# EAGLE design ctrl-pico (EAGLE 9.6.2)
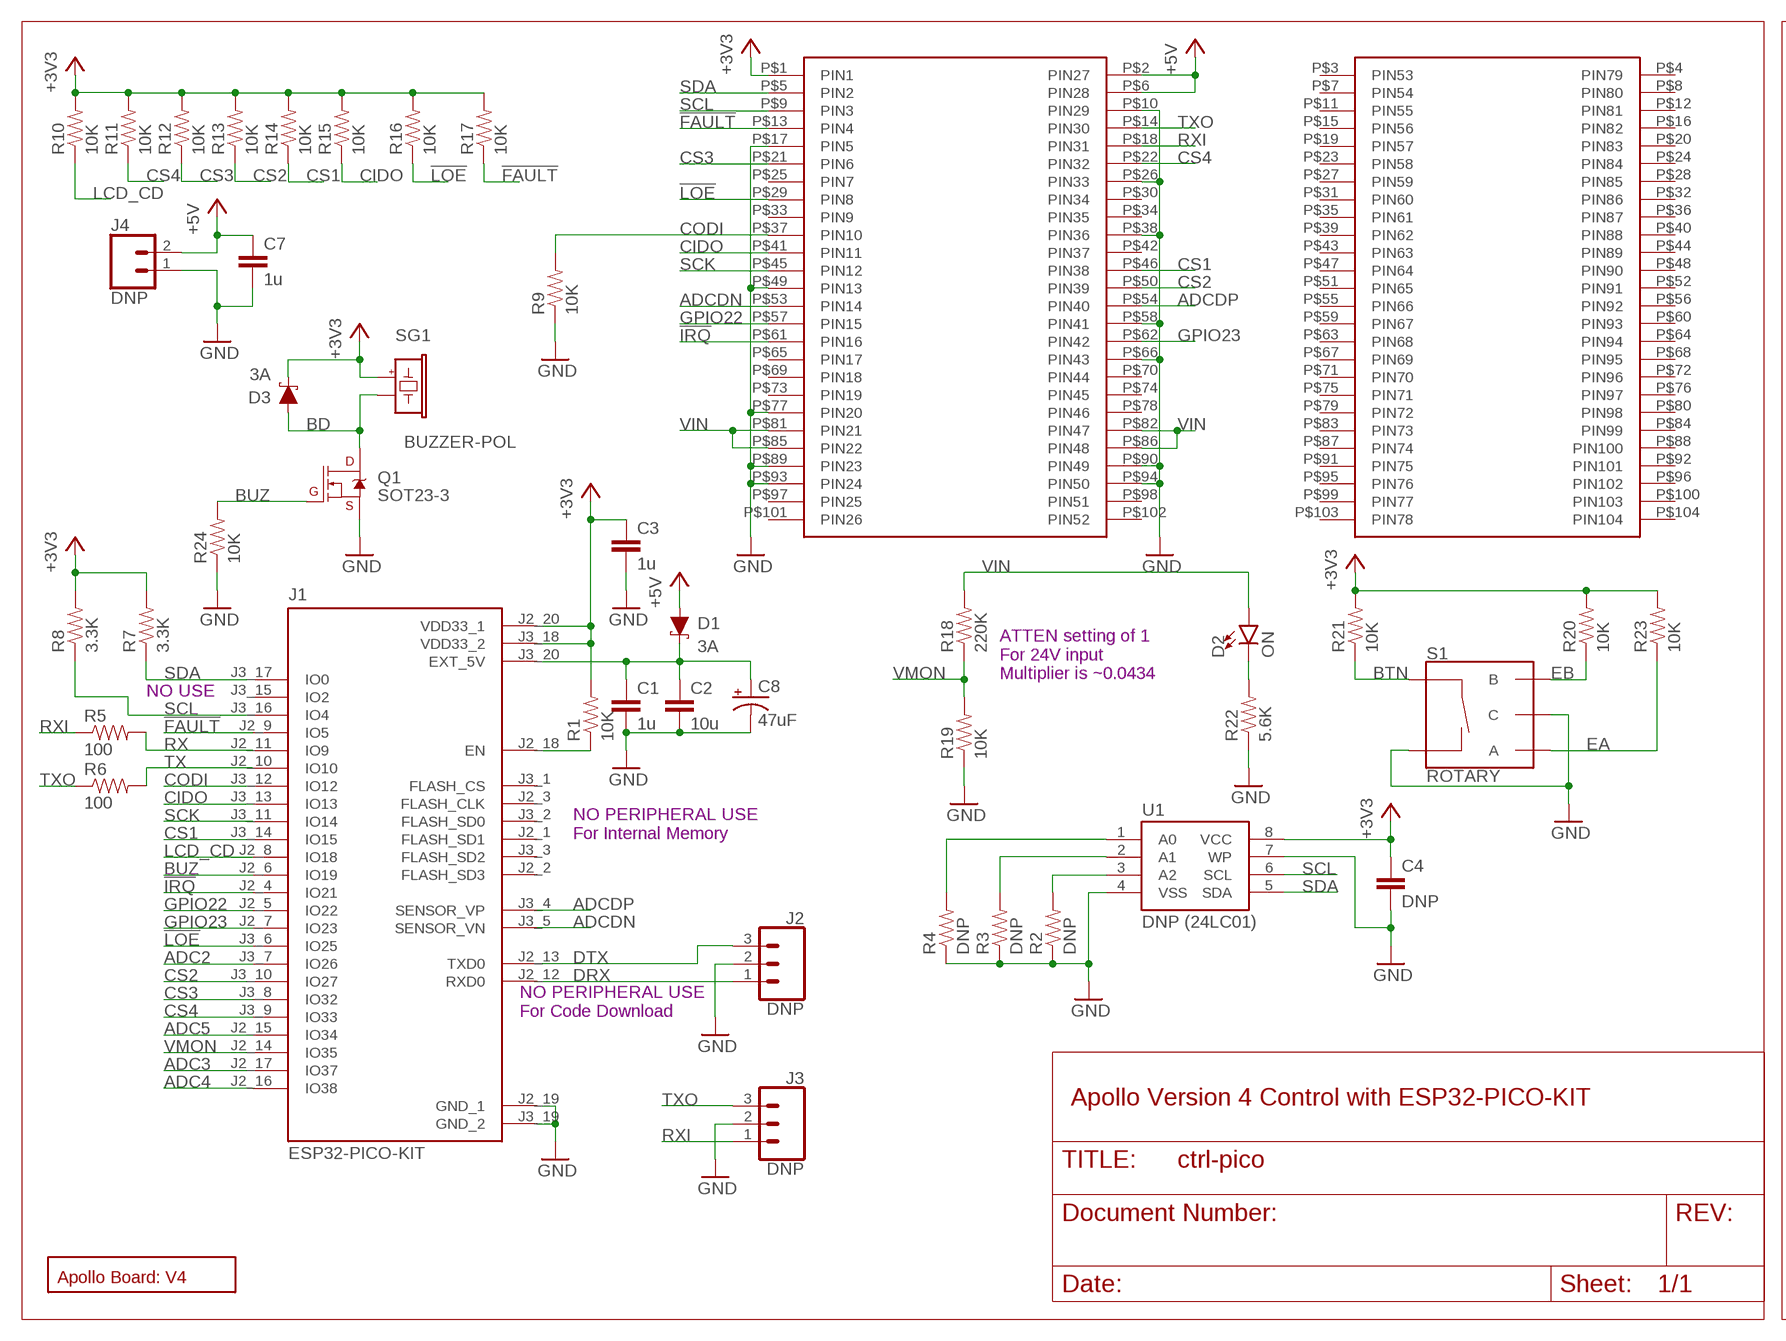
[diagram p0: schematic, sheet 1, part 1 of 2]
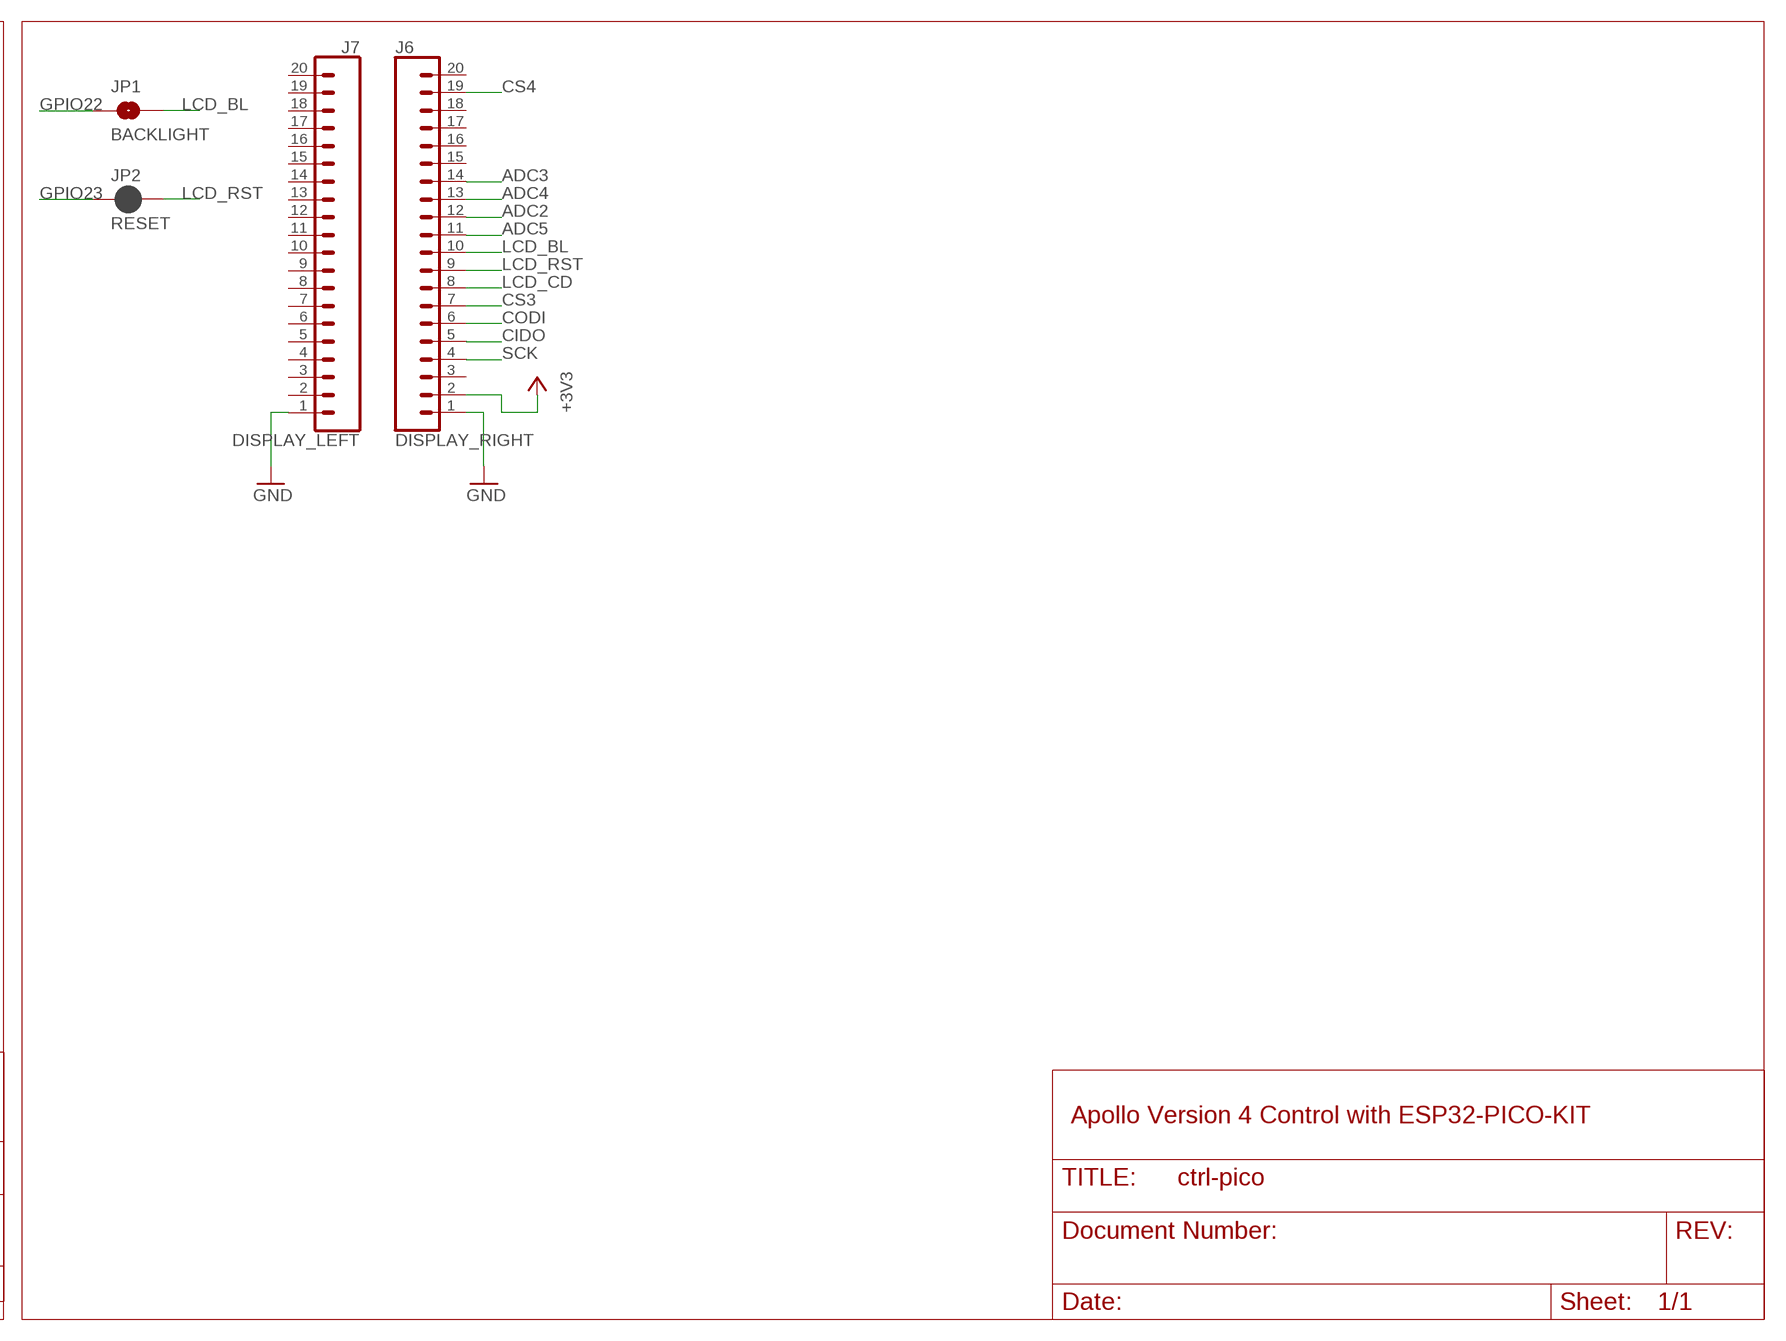
[diagram p1: schematic, sheet 1, part 2 of 2]

## Parts
C1  1u  CAP0805  [0805]
C2  10u  CAP0805  [0805]
C3  1u  CAP0805  [0805]
C4  DNP  CAP0805  [0805]
C7  1u  CAP0805  [0805]
C8  47uF  47UF-POLAR-PANASONIC_D-35V-20%  [PANASONIC_D]
D1  3A  DIODE-SCHOTTKY-B340A  [SMA-DIODE]
D2  ON  LED-GREEN0603  [LED-0603]
D3  3A  DIODE-SCHOTTKY-B340A  [SMA-DIODE]
J1  ESP32-PICO-KIT  [XCVR_ESP32-PICO-KIT]
J2  DNP  CONN_03  [1X03]
J3  DNP  CONN_03  [1X03]
J4  DNP  CONN_02  [1X02]
J6  DISPLAY_RIGHT  CONN_20  [1X20]
J7  DISPLAY_LEFT  CONN_20  [1X20]
JP1  BACKLIGHT  JUMPER-SMT_2_NO_NO-SILK  [SMT-JUMPER_2_NO_NO-SILK]
JP2  RESET  JUMPER-SMT_2_NC_PASTE_NO-SILK  [SMT-JUMPER_2_NC_PASTE_NO-SILK]
Q1  SOT23-3  MOSFET-NCH-AO3404A  [SOT23-3]
R1  10K  RESISTOR0805-RES  [0805]
R2  DNP  RESISTOR0805-RES  [0805]
R3  DNP  RESISTOR0805-RES  [0805]
R4  DNP  RESISTOR0805-RES  [0805]
R5  100  RESISTOR0805-RES  [0805]
R6  100  RESISTOR0805-RES  [0805]
R7  3.3K  RESISTOR0805-RES  [0805]
R8  3.3K  RESISTOR0805-RES  [0805]
R9  10K  RESISTOR0805-RES  [0805]
R10  10K  RESISTOR0805-RES  [0805]
R11  10K  RESISTOR0805-RES  [0805]
R12  10K  RESISTOR0805-RES  [0805]
R13  10K  RESISTOR0805-RES  [0805]
R14  10K  RESISTOR0805-RES  [0805]
R15  10K  RESISTOR0805-RES  [0805]
R16  10K  RESISTOR0805-RES  [0805]
R17  10K  RESISTOR0805-RES  [0805]
R18  220K  RESISTOR0805-RES  [0805]
R19  10K  RESISTOR0805-RES  [0805]
R20  10K  RESISTOR0805-RES  [0805]
R21  10K  RESISTOR0805-RES  [0805]
R22  5.6K  RESISTOR0805-RES  [0805]
R23  10K  RESISTOR0805-RES  [0805]
R24  10K  RESISTOR0805-RES  [0805]
S1  ROTARY  ENCODER-SWITCH  [ROTARY_ENC_PLAIN]
SG1  BUZZER-POL  [BUZZER-SMT-4]
U1  DNP (24LC01)  EEPROM-I2CSMD  [SO08]
U$1  PC104_CONNECTOR  [PC104_CONNECTOR]
U$2  BOARD_TEMPLATE1  [BOARD_TEMPLATE]

## Nets
!FAULT!: J1.J2_9(IO5) R17.1 U$1.P$13(PIN4)
!IRQ!: J1.J2_4(IO21) U$1.P$61(PIN16)
!LOE!: J1.J3_6(IO25) R16.1 U$1.P$29(PIN8)
+3V3: C3.1 C4.1 D3.C J1.J2_20(VDD33_1) J1.J3_18(VDD33_2) J6.2 R1.2 R7.2 R8.2 R10.2 R11.2 R12.2 R13.2 R14.2 R15.2 R16.2 R17.2 R20.2 R21.2 R23.2 SG1.BP(P) U1.8(VCC) U$1.P$1(PIN1)
+5V: C7.1 D1.A J4.2 U$1.P$2(PIN27) U$1.P$6(PIN28)
A0: R4.2 U1.1(A0)
A1: R3.2 U1.2(A1)
A2: R2.2 U1.3(A2)
ADC2: J1.J3_7(IO26) J6.12
ADC3: J1.J2_17(IO37) J6.14
ADC4: J1.J2_16(IO38) J6.13
ADC5: J1.J2_15(IO34) J6.11
ADCDN: J1.J3_5(SENSOR_VN) U$1.P$53(PIN14)
ADCDP: J1.J3_4(SENSOR_VP) U$1.P$54(PIN40)
BD: D3.A Q1.3(D) SG1.BM(N)
BTN: R21.1 S1.SW+
BUZ: J1.J2_6(IO19) Q1.1(G) R24.2
CIDO: J1.J3_13(IO13) J6.5 R15.1 U$1.P$41(PIN11)
CODI: J1.J3_12(IO12) J6.6 R9.2 U$1.P$37(PIN10)
CS1: J1.J3_14(IO15) R14.1 U$1.P$46(PIN38)
CS2: J1.J3_10(IO27) R13.1 U$1.P$50(PIN39)
CS3: J1.J3_8(IO32) J6.7 R12.1 U$1.P$21(PIN6)
CS4: J1.J3_9(IO33) J6.19 R11.1 U$1.P$22(PIN32)
DRX: J1.J2_12(RXD0) J2.1
DTX: J1.J2_13(TXD0) J2.3
EA: R23.1 S1.A
EB: R20.1 S1.B
EN: J1.J2_18(EN) R1.1
GND: C1.2 C2.2 C3.2 C4.2 C7.2 C8.- J1.J2_19(GND_1) J1.J3_19(GND_2) J2.2 J3.2 J4.1 J6.1 J7.1 Q1.2(S) R2.1 R3.1 R4.1 R9.1 R19.1 R22.1 R24.1 S1.C S1.SW- U1.4(VSS) U1.7(WP) U$1.P$10(PIN29) U$1.P$17(PIN5) U$1.P$26(PIN33) U$1.P$38(PIN36) U$1.P$49(PIN13) U$1.P$58(PIN41) U$1.P$66(PIN43) U$1.P$77(PIN20) U$1.P$89(PIN23) U$1.P$90(PIN49) U$1.P$93(PIN24) U$1.P$94(PIN50)
GPIO22: J1.J2_5(IO22) JP1.1 U$1.P$57(PIN15)
GPIO23: J1.J2_7(IO23) JP2.1 U$1.P$62(PIN42)
LCD_BL: J6.10 JP1.2
LCD_CD: J1.J2_8(IO18) J6.8 R10.1
LCD_RST: J6.9 JP2.2
RX: J1.J2_11(IO9) R5.2
RXI: J3.1 R5.1 U$1.P$18(PIN31)
SCK: J1.J3_11(IO14) J6.4 U$1.P$45(PIN12)
SCL: J1.J3_16(IO4) R8.1 U1.6(SCL) U$1.P$9(PIN3)
SDA: J1.J3_17(IO0) R7.1 U1.5(SDA) U$1.P$5(PIN2)
TX: J1.J2_10(IO10) R6.2
TXO: J3.3 R6.1 U$1.P$14(PIN30)
USB5V: C1.1 C2.1 C8.+ D1.C J1.J3_20(EXT_5V)
VIN: D2.A R18.2 U$1.P$81(PIN21) U$1.P$82(PIN47) U$1.P$85(PIN22) U$1.P$86(PIN48)
VLED: D2.C R22.2
VMON: J1.J2_14(IO35) R18.1 R19.2
Unconnected: J1.J2_1(FLASH_SD1) J1.J2_2(FLASH_SD3) J1.J2_3(FLASH_CLK) J1.J3_1(FLASH_CS) J1.J3_2(FLASH_SD0) J1.J3_3(FLASH_SD2) J1.J3_15(IO2) J6.3 J6.15 J6.16 J6.17 J6.18 J6.20 J7.2 J7.3 J7.4 J7.5 J7.6 J7.7 J7.8 J7.9 J7.10 J7.11 J7.12 J7.13 J7.14 J7.15 J7.16 J7.17 J7.18 J7.19 J7.20 U$1.P$3(PIN53) U$1.P$4(PIN79) U$1.P$7(PIN54) U$1.P$8(PIN80) U$1.P$11(PIN55) U$1.P$12(PIN81) U$1.P$15(PIN56) U$1.P$16(PIN82) U$1.P$19(PIN57) U$1.P$20(PIN83) U$1.P$23(PIN58) U$1.P$24(PIN84) U$1.P$25(PIN7) U$1.P$27(PIN59) U$1.P$28(PIN85) U$1.P$30(PIN34) U$1.P$31(PIN60) U$1.P$32(PIN86) U$1.P$33(PIN9) U$1.P$34(PIN35) U$1.P$35(PIN61) U$1.P$36(PIN87) U$1.P$39(PIN62) U$1.P$40(PIN88) U$1.P$42(PIN37) U$1.P$43(PIN63) U$1.P$44(PIN89) U$1.P$47(PIN64) U$1.P$48(PIN90) U$1.P$51(PIN65) U$1.P$52(PIN91) U$1.P$55(PIN66) U$1.P$56(PIN92) U$1.P$59(PIN67) U$1.P$60(PIN93) U$1.P$63(PIN68) U$1.P$64(PIN94) U$1.P$65(PIN17) U$1.P$67(PIN69) U$1.P$68(PIN95) U$1.P$69(PIN18) U$1.P$70(PIN44) U$1.P$71(PIN70) U$1.P$72(PIN96) U$1.P$73(PIN19) U$1.P$74(PIN45) U$1.P$75(PIN71) U$1.P$76(PIN97) U$1.P$78(PIN46) U$1.P$79(PIN72) U$1.P$80(PIN98) U$1.P$83(PIN73) U$1.P$84(PIN99) U$1.P$87(PIN74) U$1.P$88(PIN100) U$1.P$91(PIN75) U$1.P$92(PIN101) U$1.P$95(PIN76) U$1.P$96(PIN102) U$1.P$97(PIN25) U$1.P$98(PIN51) U$1.P$99(PIN77) U$1.P$100(PIN103) U$1.P$101(PIN26) U$1.P$102(PIN52) U$1.P$103(PIN78) U$1.P$104(PIN104)

## Notes on the sheet
- ATTEN setting of 1
  For 24V input
  Multiplier is ~0.0434
- NO USE
- NO PERIPHERAL USE
  For Internal Memory
- NO PERIPHERAL USE
  For Code Download
- Apollo Version 4 Control with ESP32-PICO-KIT
- Apollo Version 4 Control with ESP32-PICO-KIT

## Library data of the parts
C1-C4 C7 = apollo-ctrl-v4:CAP: Capacitor Standard 0603 ceramic capacitor, and 0.1" leaded capacitor.
C8 = SparkFun-Capacitors:47UF-POLAR: 47µF polarized capacitors A capacitor is a passive two-terminal electrical component used to store electrical energy temporarily in an electric field.; PROD_ID: CAP-08478
D1 D3 = SparkFun-DiscreteSemi:DIODE-SCHOTTKY: Schottky diode A Schottky diode is a semiconductor diode which has a low forward voltage drop and a very fast switching action.; PROD_ID: DIO-09886; VALUE: 3A/40V/500mV
D2 = SparkFun-LED:LED-GREEN: Green SMD LED Used in manufacturing of various products at SparkFun Packages: 0603 - SMD 0603 package [Product Link] <http://www.futureelectronics.com/en/technologies/semiconductors/optoelectronics/leds/Pages/9894312-LTST-C190GKT.aspx?CrossPart=HSMG-C190&IM=0> LilyPad 1206 - SMD1206 LilyPad package [Product Link] <http://www.futureelectronics.com/en/Technologies/Product.aspx?ProductID=IN150NGHARVATEKCORPORATION2049943&IM=0> 1206 - SMD1206 package [Product Link] <http://www.futureelectronics.com/en/technologies/semiconductors/optoelectronics/leds/Pages/8315665-LTST-C150KGKT.aspx?IM=0> 1206 Bottom Mount -SMD 1206 Bottom Mount [Product Link] <http://www.digikey.com/product-detail/en/lite-on-inc/LTST-C230KGKT/160-1456-1-ND/386854> SparkFun Products: Pro Mini 328 -5V <https://www.sparkfun.com/products/821> RedBoard <https://www.sparkfun.com/products/12757> MP3 Trigger <https://www.sparkfun.com/products/13720> Makey Makey <https://www.sparkfun.com/products/11076>; PROD_ID: DIO-00821; VALUE: GREEN
J1 = ESP32-PICO-KIT:ESP32-PICO-KIT: Esp32 Wifi Bluetooth Eval Board; DESCRIPTION: - Transceiver; 802.11 b/g/n (Wi-Fi, WiFi, WLAN), Bluetooth® Smart Ready 4.x Dual Mode For Use With ESP32-PICO-D4; DIGI-KEY_PART_NUMBER: 1965-1004-ND; DIGIKEY-PURCHASE-URL: https://snapeda.com/shop?store=DigiKey&id=2777057; MF: Espressif Systems; MOUSER-PURCHASE-URL: https://snapeda.com/shop?store=Mouser&id=2777057; MP: ESP32-PICO-KIT; PACKAGE: None
J2 J3 = SparkFun-Connectors:CONN_03: Multi connection point. Often used as Generic Header-pin footprint for 0.1 inch spaced/style header connections On any of the 0.1 inch spaced packages, you can populate with these: Break Away Headers - Straight <https://www.sparkfun.com/products/116> (PRT-00116) Break Away Male Headers - Right Angle <https://www.sparkfun.com/products/553> (PRT-00553) Female Headers <https://www.sparkfun.com/products/115> (PRT-00115) Break Away Headers - Machine Pin <https://www.sparkfun.com/products/117> (PRT-00117) Break Away Female Headers - Swiss Machine Pin <https://www.sparkfun.com/products/743> (PRT-00743) Stackable Header - 3 Pin (Female, 0.1") <https://www.sparkfun.com/products/13875> (PRT-13875) For SCREWTERMINALS and SPRING TERMINALS visit here: Screw Terimnals on SparkFun.com <https://www.sparkfun.com/search/results?term=Screw+Terminals> (5mm/3.5mm/2.54mm spacing) This device is also useful as a general connection point to wire up your design to another part of your project. Our various solder wires solder well into these plated through hole pads. Hook-Up Wire - Assortment (Stranded, 22 AWG) <https://www.sparkfun.com/products/11375> (PRT-11375) Hook-Up Wire - Assortment (Solid Core, 22 AWG) <https://www.sparkfun.com/products/11367> (PRT-11367) View the entire wire category on our website here <https://www.sparkfun.com/categories/141> Special notes: Molex polarized connector foot print use with SKU : PRT-08232 with associated crimp pins and housings.; PROD_ID: XXX-00000; VALUE: 455-1750-1-ND
J4 = SparkFun-Connectors:CONN_02: Multi connection point. Often used as Generic Header-pin footprint for 0.1 inch spaced/style header connections On any of the 0.1 inch spaced packages, you can populate with these: Break Away Headers - Straight <https://www.sparkfun.com/products/116> (PRT-00116) Break Away Male Headers - Right Angle <https://www.sparkfun.com/products/553> (PRT-00553) Female Headers <https://www.sparkfun.com/products/115> (PRT-00115) Break Away Headers - Machine Pin <https://www.sparkfun.com/products/117> (PRT-00117) Break Away Female Headers - Swiss Machine Pin <https://www.sparkfun.com/products/743> (PRT-00743) For SCREWTERMINALS and SPRING TERMINALS visit here: Screw Terimnals on SparkFun.com <https://www.sparkfun.com/search/results?term=Screw+Terminals> (5mm/3.5mm/2.54mm spacing) This device is also useful as a general connection point to wire up your design to another part of your project. Our various solder wires solder well into these plated through hole pads. Hook-Up Wire - Assortment (Stranded, 22 AWG) <https://www.sparkfun.com/products/11375> (PRT-11375) Hook-Up Wire - Assortment (Solid Core, 22 AWG) <https://www.sparkfun.com/products/11367> (PRT-11367) View the entire wire category on our website here <https://www.sparkfun.com/categories/141> Special notes: Molex polarized connector foot print use with: PRT-08233 with associated crimp pins and housings. 2.54_SCREWTERM for use with PRT-10571. 3.5mm Screw Terminal footprints for PRT-08084 5mm Screw Terminal footprints for use with PRT-08432
J6 J7 = SparkFun-Connectors:CONN_20: Multi connection point. Often used as Generic Header-pin footprint for 0.1 inch spaced/style header connections On any of the 0.1 inch spaced packages, you can populate with these: Break Away Headers - Straight <https://www.sparkfun.com/products/116> (PRT-00116) Break Away Male Headers - Right Angle <https://www.sparkfun.com/products/553> (PRT-00553) Female Headers <https://www.sparkfun.com/products/115> (PRT-00115) Break Away Headers - Machine Pin <https://www.sparkfun.com/products/117> (PRT-00117) Break Away Female Headers - Swiss Machine Pin <https://www.sparkfun.com/products/743> (PRT-00743) For SCREWTERMINALS and SPRING TERMINALS visit here: Screw Terimnals on SparkFun.com <https://www.sparkfun.com/search/results?term=Screw+Terminals> (5mm/3.5mm/2.54mm spacing) This device is also useful as a general connection point to wire up your design to another part of your project. Our various solder wires solder well into these plated through hole pads. Hook-Up Wire - Assortment (Stranded, 22 AWG) <https://www.sparkfun.com/products/11375> (PRT-11375) Hook-Up Wire - Assortment (Solid Core, 22 AWG) <https://www.sparkfun.com/products/11367> (PRT-11367) View the entire wire category on our website here <https://www.sparkfun.com/categories/141> Special notes: Molex polarized connector foot print use with SKU : PRT-08231 with associated crimp pins and housings. 1MM SMD Version SKU: PRT-10208 NOTES ON THE VARIANTS LOCK and LOCK_LONGPADS... This footprint was designed to help hold the alignment of a through-hole component (i.e. 6-pin header) while soldering it into place. You may notice that each hole has been shifted either up or down by 0.005 of an inch from it's more standard position (which is a perfectly straight line). This slight alteration caused the pins (the squares in the middle) to touch the edges of the holes. Because they are alternating, it causes a "brace" to hold the component in place. 0.005 has proven to be the perfect amount of "off-center" position when using our standard breakaway headers. Although looks a little odd when you look at the bare footprint, once you have a header in there, the alteration is very hard to notice. Also,if you push a header all the way into place, it is covered up entirely on the bottom side. Note about LOCK SPECIAL package: This is just like the LOCK variant in that the holes are staggared by 5 mil, but except for the last two holes. They are not altered from the "standard" footprint layout. This is used for a special purpose on the layout of our Graphic LCD Backpack. Make sure you want to use this device before selecting it for you project!
JP1 = SparkFun-Jumpers:JUMPER-SMT_2_NO: Normally open jumper This jumper has two pads in close proximity to each other. Apply solder to close the connection. Round pads are easier to solder for beginners, but are a lot larger. SparkFun Product that uses the round pads: SparkFun EL Sequencer <https://www.sparkfun.com/products/12781>
JP2 = SparkFun-Jumpers:JUMPER-SMT_2_NC_PASTE: Normally closed solder jumper This jumper has an aperture in the stencil to allow solder paste to bridge the split in the wire so it's normally closed (NC). Wick off the solder to open the connection. Reapply solder to reclose the connection.
Q1 = SparkFun-DiscreteSemi:MOSFET-NCH: N-channel MOSFETs Voltage controlled devices that allow control of high current outputs. SparkFun Products: SparkFun OpenScale <https://www.sparkfun.com/products/13261> SparkFun Digital Sandbox <https://www.sparkfun.com/products/12651> SparkFun Monster Moto Shield <https://www.sparkfun.com/products/10182> SparkFun MOSFET Power Controller <https://www.sparkfun.com/products/11214>; PROD_ID: TRANS-12988; VALUE: 5.8A/30V/35mΩ
R1-R24 = apollo-ctrl-v4:RESISTOR: Resistor Basic schematic elements and footprints for 0603, 1206, and PTH resistors.
S1 = SparkFun-Switches:ENCODER-SWITCH: Rotary Encoder w/ Select Switch Encoders rotate similarly to potentiometers, but they’re different from potentiometers in that an encoder has full rotation without limits. They output gray code so that you can tell how much and in which direction the encoder has been turned. This encoder includes a push-down select switch built into the shaft. SparkFun Products Rotary Encoder <https://www.sparkfun.com/products/9117> (COM-09117); SF_SKU: COM-09117
SG1 = apollo-ctrl-v4:BUZZER-POL
U1 = SparkFun-IC-Memory:EEPROM-I2C: I2C EEPROMs, 24LC256 and others 24LC256 Series 256 kb I2C 2 Wire (32 k x 8 Bit) 2.5 V Serial EEPROM SMD - SOIC-8 Datasheet SparkFun Products SparkFun UDB5 - PIC UAV Development Board <https://www.sparkfun.com/products/11703> (GPS-11703); PROD_ID: IC-09714; VALUE: 24LC256
U$1 = template_board:PC104_CONNECTOR
U$2 = template_board:BOARD_TEMPLATE

## Board
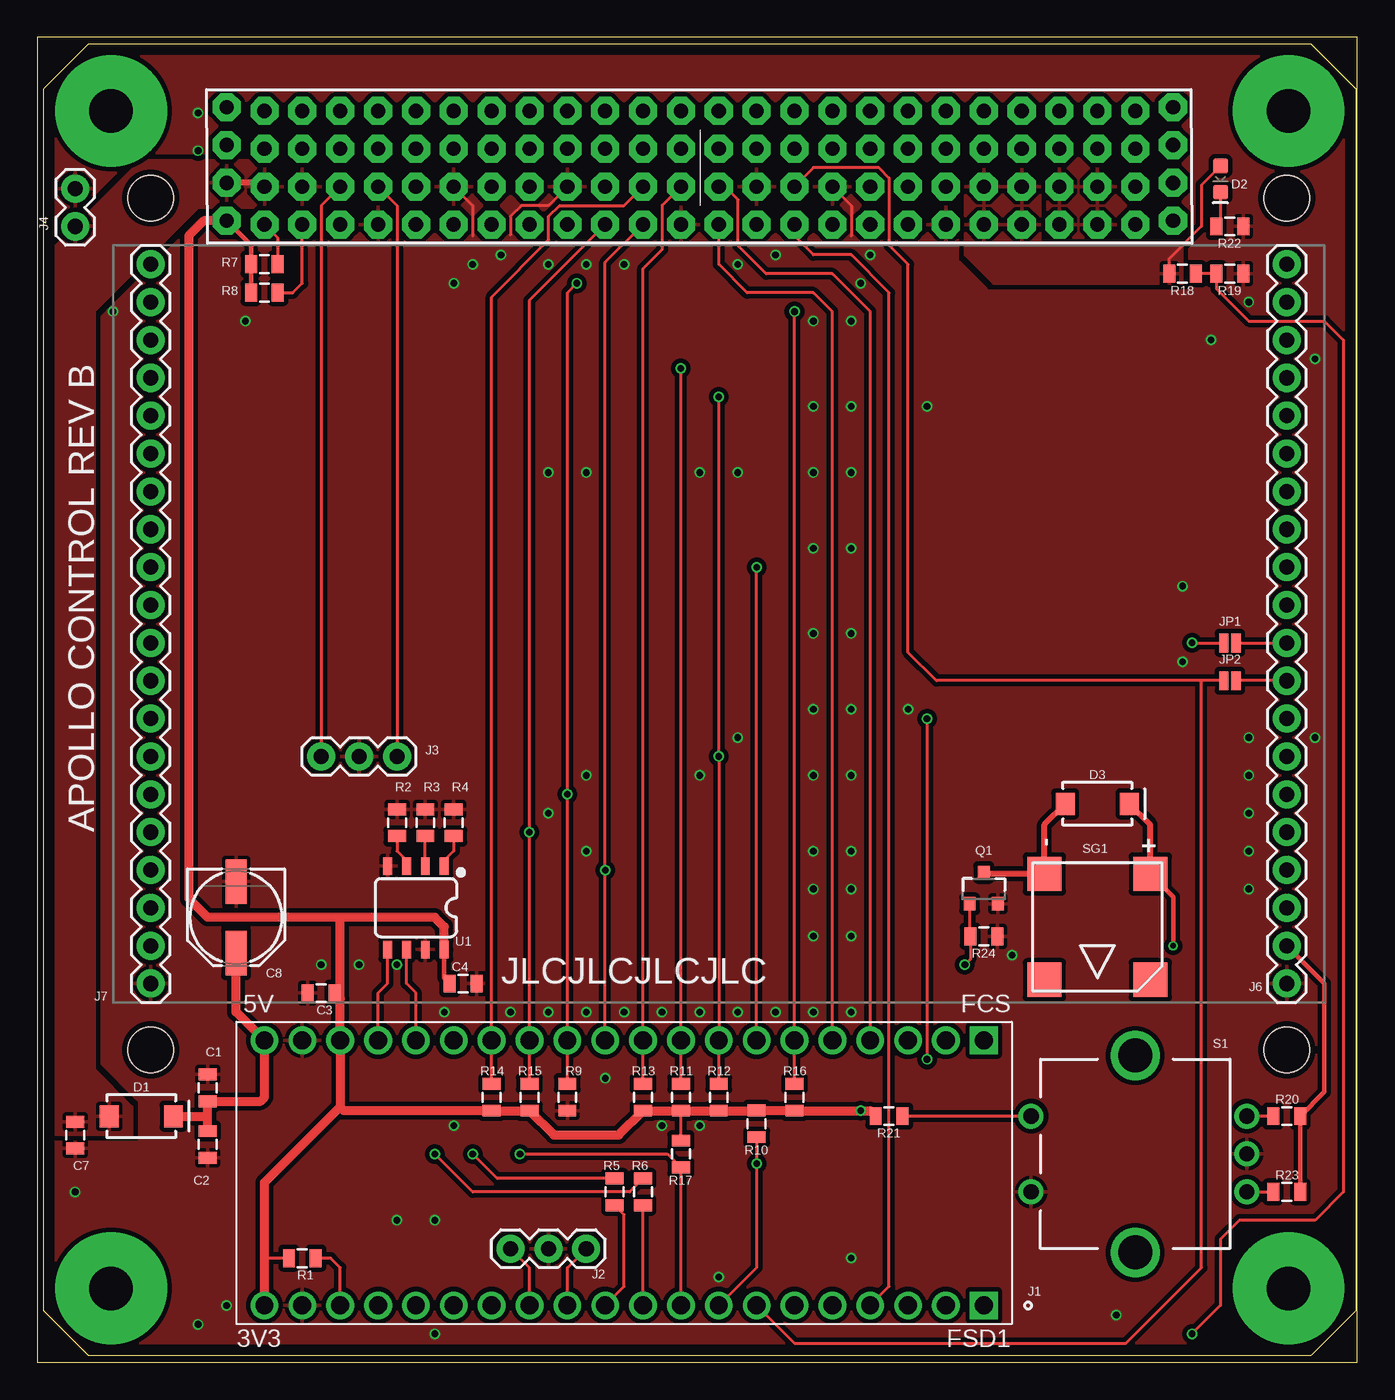
[diagram p2: board, top side]
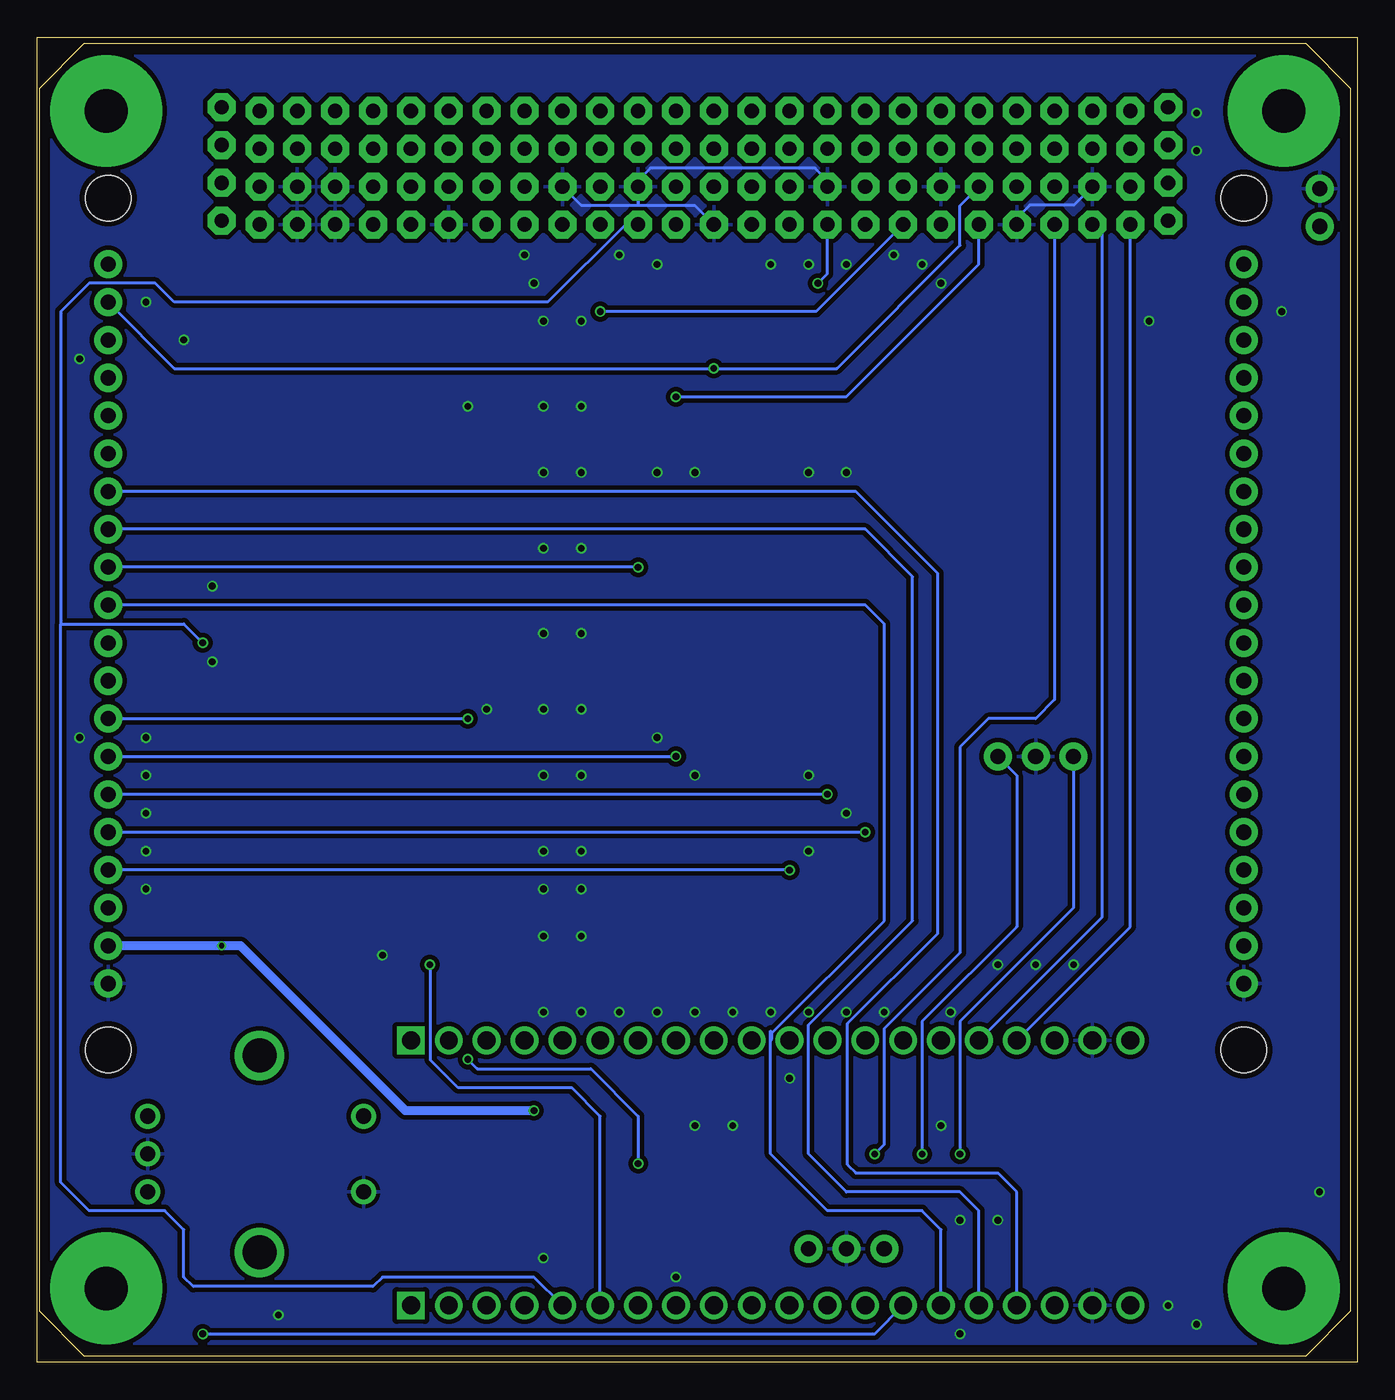
[diagram p3: board, bottom side, seen from below]

Size 88.57 x 88.89 mm. Coordinates in mm from the lower left corner, seen from the top.
Outline: 0,0 88.57,0 88.57,88.89 0,88.89 0,0
Copper layers (1*16): Top 0.035559375mm / dielectric 1.6mm / Bottom 0.035559375mm
Design rules "jlcpcb-2layer *": minimum track width 6mil, minimum drill 10mil, track to track 6mil, track to pad 6mil, pad to pad 6mil, via to via 6mil, smd to smd 6mil, copper to edge 15mil, drill to drill 6mil, minimum pad ring 13mil, minimum via ring 5mil, stop-mask expansion 2.5mil, vias tented up to drill 0mil, thermal gap 10mil
Holes 3.05 mm at 7.62,20.95 7.62,78.11 83.82,78.11 83.82,20.95

### Footprints (pad centres in the part's own frame; a part is rotated, then mirrored left to right if it is on the bottom)
0805 = smd 0.8 x 1.2: 1 -0.9,0; 2 0.9,0
PANASONIC_D = smd 3 x 1.4: + 2.4,0; - -2.4,0
SMA-DIODE = smd 1.27 x 1.47: A -2.15,0; C 2.15,0
LED-0603 = smd 1 x 1: A -0.877,0; C 0.877,0
XCVR_ESP32-PICO-KIT = drill 1.2 square: J2_1 -24.13,8.89; J3_1 -24.13,-8.89 | drill 1.2: J2_2 -21.59,8.89; J2_3 -19.05,8.89; J2_4 -16.51,8.89; J2_5 -13.97,8.89; J2_6 -11.43,8.89; J2_7 -8.89,8.89; J2_8 -6.35,8.89; J2_9 -3.81,8.89; J2_10 -1.27,8.89; J2_11 1.27,8.89; J2_12 3.81,8.89; J2_13 6.35,8.89; J2_14 8.89,8.89; J2_15 11.43,8.89; J2_16 13.97,8.89; J2_17 16.51,8.89; J2_18 19.05,8.89; J2_19 21.59,8.89; J2_20 24.13,8.89; J3_2 -21.59,-8.89; J3_3 -19.05,-8.89; J3_4 -16.51,-8.89; J3_5 -13.97,-8.89; J3_6 -11.43,-8.89; J3_7 -8.89,-8.89; J3_8 -6.35,-8.89; J3_9 -3.81,-8.89; J3_10 -1.27,-8.89; J3_11 1.27,-8.89; J3_12 3.81,-8.89; J3_13 6.35,-8.89; J3_14 8.89,-8.89; J3_15 11.43,-8.89; J3_16 13.97,-8.89; J3_17 16.51,-8.89; J3_18 19.05,-8.89; J3_19 21.59,-8.89; J3_20 24.13,-8.89
1X03 = drill 1.016 pad 1.88: 1 0,0; 2 2.54,0; 3 5.08,0
1X02 = drill 1.016 pad 1.88: 1 0,0; 2 2.54,0
1X20 = drill 1.016 pad 1.88: 1 0,0; 2 2.54,0; 3 5.08,0; 4 7.62,0; 5 10.16,0; 6 12.7,0; 7 15.24,0; 8 17.78,0; 9 20.32,0; 10 22.86,0; 11 25.4,0; 12 27.94,0; 13 30.48,0; 14 33.02,0; 15 35.56,0; 16 38.1,0; 17 40.64,0; 18 43.18,0; 19 45.72,0; 20 48.26,0
SMT-JUMPER_2_NO_NO-SILK = smd 0.635 x 1.27: 1 -0.406,0; 2 0.406,0
SMT-JUMPER_2_NC_PASTE_NO-SILK = smd 0.635 x 1.27: 1 -0.406,0; 2 0.406,0
SOT23-3 = smd 0.8 x 0.9: 1 -0.95,-1; 2 0.95,-1; 3 0,1.1
ROTARY_ENC_PLAIN = drill 1.016: A 7.493,-2.54; B 7.493,2.54; C 7.493,0; SW+ -6.985,2.54; SW- -6.985,-2.54 | drill 2.286: P$3 0,6.604; P$4 0,-6.604
BUZZER-SMT-4 = smd 2.3 x 2.3: BM -3.55,-3.55; BP -3.55,3.55; NC1 3.55,3.55; NC2 3.55,-3.55
SO08 = smd 0.6 x 1.2: 1 -1.905,-2.8; 2 -0.635,-2.8; 3 0.635,-2.8; 4 1.905,-2.8; 5 1.905,2.8; 6 0.635,2.8; 7 -0.635,2.8; 8 -1.905,2.8
PC104_CONNECTOR = drill 0.953 pad 1.88 octagon: P$1 -31.75,32.134; P$2 -31.75,34.674; P$3 -31.75,37.214; P$4 -31.75,39.754; P$5 -29.21,31.88; P$6 -29.21,34.42; P$7 -29.21,36.96; P$8 -29.21,39.5; P$9 -26.67,31.88; P$10 -26.67,34.42; P$11 -26.67,36.96; P$12 -26.67,39.5; P$13 -24.13,31.88; P$14 -24.13,34.42; P$15 -24.13,36.96; P$16 -24.13,39.5; P$17 -21.59,31.88; P$18 -21.59,34.42; P$19 -21.59,36.96; P$20 -21.59,39.5; P$21 -19.05,31.88; P$22 -19.05,34.42; P$23 -19.05,36.96; P$24 -19.05,39.5; P$25 -16.51,31.88; P$26 -16.51,34.42; P$27 -16.51,36.96; P$28 -16.51,39.5; P$29 -13.97,31.88; P$30 -13.97,34.42; P$31 -13.97,36.96; P$32 -13.97,39.5; P$33 -11.43,31.88; P$34 -11.43,34.42; P$35 -11.43,36.96; P$36 -11.43,39.5; P$37 -8.89,31.88; P$38 -8.89,34.42; P$39 -8.89,36.96; P$40 -8.89,39.5; P$41 -6.35,31.88; P$42 -6.35,34.42; P$43 -6.35,36.96; P$44 -6.35,39.5; P$45 -3.81,31.88; P$46 -3.81,34.42; P$47 -3.81,36.96; P$48 -3.81,39.5; P$49 -1.27,31.88; P$50 -1.27,34.42; P$51 -1.27,36.96; P$52 -1.27,39.5; P$53 1.27,31.88; P$54 1.27,34.42; P$55 1.27,36.96; P$56 1.27,39.5; P$57 3.81,31.88; P$58 3.81,34.42; P$59 3.81,36.96; P$60 3.81,39.5; P$61 6.35,31.88; P$62 6.35,34.42; P$63 6.35,36.96; P$64 6.35,39.5; P$65 8.89,31.88; P$66 8.89,34.42; P$67 8.89,36.96; P$68 8.89,39.5; P$69 11.43,31.88; P$70 11.43,34.42; P$71 11.43,36.96; P$72 11.43,39.5; P$73 13.97,31.88; P$74 13.97,34.42; P$75 13.97,36.96; P$76 13.97,39.5; P$77 16.51,31.88; P$78 16.51,34.42; P$79 16.51,36.96; P$80 16.51,39.5; P$81 19.05,31.88; P$82 19.05,34.42; P$83 19.05,36.96; P$84 19.05,39.5; P$85 21.59,31.88; P$86 21.59,34.42; P$87 21.59,36.96; P$88 21.59,39.5; P$89 24.13,31.88; P$90 24.13,34.42; P$91 24.13,36.96; P$92 24.13,39.5; P$93 26.67,31.88; P$94 26.67,34.42; P$95 26.67,36.96; P$96 26.67,39.5; P$97 29.21,31.88; P$98 29.21,34.42; P$99 29.21,36.96; P$100 29.21,39.5; P$101 31.75,32.134; P$102 31.75,34.674; P$103 31.75,37.214; P$104 31.75,39.754
BOARD_TEMPLATE = drill 2.9 pad 7.5: P$1 -39.5,39.5; P$2 -39.5,-39.5; P$3 39.5,-39.5; P$4 39.5,39.5

### Placement (x,y rotation side)
C1  11.43,18.41 90 top
C2  11.43,14.61 270 top
C3  19.05,24.77 180 top
C4  28.57,25.4 0 top
C7  2.54,15.24 270 top
C8  13.34,29.84 270 top
D1  6.99,16.51 0 top
D2  79.38,79.38 270 top
D3  71.12,37.47 0 top
J1  39.37,12.7 180 top
J2  36.83,7.62 180 top
J3  24.13,40.64 180 top
J4  2.54,78.74 270 top
J6  83.82,25.4 90 top
J7  7.62,25.4 90 top
JP1  80.01,48.26 0 top
JP2  80.01,45.72 0 top
Q1  63.5,31.75 0 top
R1  17.78,6.99 180 top
R2  24.13,36.2 270 top
R3  26.04,36.2 270 top
R4  27.94,36.2 270 top
R5  38.73,11.43 270 top
R6  40.64,11.43 270 top
R7  15.24,73.66 180 top
R8  15.24,71.75 180 top
R9  35.56,17.78 90 top
R10  48.26,16 90 top
R11  43.18,17.78 270 top
R12  45.72,17.78 270 top
R13  40.64,17.78 270 top
R14  30.48,17.78 270 top
R15  33.02,17.78 270 top
R16  50.8,17.78 270 top
R17  43.18,13.97 90 top
R18  76.83,73.03 180 top
R19  80.01,73.03 180 top
R20  83.82,16.51 0 top
R21  57.15,16.51 180 top
R22  80.01,76.2 180 top
R23  83.82,11.43 0 top
R24  63.5,28.57 180 top
S1  73.66,13.97 0 top
SG1  71.12,29.21 270 top
U1  25.4,30.48 180 top
U$1  44.45,44.45 0 top
U$2  44.45,44.45 0 top

### Tracks (layer width: path | path; a pad name or v marks a point on that pad's centre or on a via)
!FAULT!  (via drill 0.45)
  Top 0.203: J1.J2_9 R17.1 42.28,13.97 v32.38,13.97
  Bottom 0.203: U$1.P$13 20.32,44.45 21.59,43.18 24.77,43.18 26.67,41.27 26.67,27.46 31.75,22.39 31.75,14.61 v32.38,13.97
!IRQ!
  Top 0.203: J1.J2_4 57.15,5.08 57.15,71.75 54.61,74.3 52.07,74.3 50.8,75.56 U$1.P$61
!LOE!  (via drill 0.45)
  Top 0.203: R16.1 J1.J3_6 v50.8,70.48
  Bottom 0.203: U$1.P$29 36.33,70.48 v50.8,70.48
+3V3  (via drill 0.35, 0.45)
  Top 0.203: R17.2 R11.2 | R1.2 15.24,6.99
  Top 0.305: U1.8 27.3,25.77 C4.1 | R8.2 R7.2 14.34,74.94 U$1.P$1 | R23.2 R20.2 86.36,18.15 86.36,25.4 J6.2 | SG1.BP 76.2,31.23 v76.2,27.94
  Top 0.406: SG1.BP 74.67,36.06 D3.C
  Top 0.61: U$1.P$1 11.18,76.58 10.16,75.56 10.16,31.11 11.43,29.84 20.32,29.84 | 20.32,29.84 26.67,29.84 27.3,29.21 U1.8 | 20.32,24.39 J1.J3_18 20.32,17.14 | 20.32,24.39 20.32,29.84 | C3.1 20.32,24.39 | 20.32,17.14 20.59,16.88 R14.2 R15.2 34.66,15.24 39,15.24 R13.2 R11.2 | 20.32,17.14 15.24,12.06 15.24,6.99 J1.J2_20 | 43.2,16.9 R11.2 | R11.2 R12.2 48.28,16.88 R10.2 50.78,16.9 R16.2 v55.24,16.88 55.88,16.88 R21.2
  Bottom 0.61: J6.2 v76.2,27.94 74.93,27.94 63.87,16.88 v55.24,16.88
+5V
  Top 0.406: U$1.P$6 14.99,79.12 U$1.P$2
  pour Top (isolate 0.305): 16.51,80.64 16.51,77.47 10.79,77.47 3.81,70.48 3.81,19.68 6.35,17.14 6.35,15.24 1.27,15.24 1.27,74.93 6.99,80.64
A0
  Top 0.203: R4.2 27.94,34.29 27.3,33.66 U1.1
A1
  Top 0.203: U1.2 R3.2
A2
  Top 0.203: R2.2 24.13,34.29 24.77,33.66 U1.3
ADC2  (via drill 0.45)
  Top 0.203: J1.J3_7 v48.26,53.34
  Bottom 0.203: v48.26,53.34 J6.12
ADC3
  Bottom 0.203: J1.J2_17 22.86,11.43 24.13,12.7 33.66,12.7 34.2,13.25 34.2,22.72 28.16,28.77 28.16,52.93 33.66,58.42 J6.14
ADC4
  Bottom 0.203: J1.J2_16 25.4,10.16 26.67,11.43 34.29,11.43 36.83,13.97 36.83,22.64 29.84,29.62 29.84,52.7 33.02,55.88 J6.13
ADC5
  Bottom 0.203: J1.J2_15 27.94,8.89 29.21,10.16 35.56,10.16 39.37,13.97 39.37,21.59 | 39.37,21.59 39.37,22.23 | 39.37,21.59 39.28,21.68 39.28,22.08 31.75,29.61 31.75,49.53 33.02,50.8 J6.11
ADCDN
  Top 0.203: U$1.P$53 45.72,73.66 47.62,71.75 52.07,71.75 53.34,70.48 J1.J3_5
ADCDP
  Top 0.203: J1.J3_4 55.88,70.48 53.34,73.03 48.9,73.03 47.02,74.91 47.02,77.99 46.14,78.87 U$1.P$54
BD
  Top 0.406: D3.A 67.57,36.06 SG1.BM 63.59,32.76 Q1.3
BTN
  Top 0.203: S1.SW+ R21.1
BUZ  (via drill 0.45)
  Top 0.203: Q1.1 62.55,28.62 R24.2 62.6,27.04 v62.23,26.67
  Bottom 0.203: J1.J2_6 50.8,16.51 52.7,18.41 60.33,18.41 62.2,20.3 62.2,26.64 v62.23,26.67
CIDO  (via drill 0.45)
  Top 0.203: R15.1 J1.J3_13 v33.02,35.56 33.02,71.25 U$1.P$41
  Bottom 0.203: J6.5 v33.02,35.56
CODI  (via drill 0.45)
  Top 0.203: R9.2 J1.J3_12 v35.56,38.1 35.56,71.75 v36.2,72.39
  Bottom 0.203: v36.2,72.39 35.56,73.03 U$1.P$37 | v35.56,38.1 J6.6
CS1
  Top 0.203: R14.1 J1.J3_14 30.48,71.47 34.31,75.3 34.31,76.88 35.04,77.6 39.37,77.6 U$1.P$46
CS2
  Top 0.203: R13.1 J1.J3_10 40.64,73.37 41.94,74.67 41.94,77.62 U$1.P$50
CS3  (via drill 0.45)
  Top 0.203: v45.72,64.77 v45.72,40.64 J1.J3_8 R12.1
  Bottom 0.203: v45.72,64.77 34.29,64.77 25.4,73.66 U$1.P$21 | J6.7 v45.72,40.64
CS4  (via drill 0.45)
  Top 0.203: R11.1 J1.J3_9 v43.18,66.67
  Bottom 0.203: J6.19 79.38,66.67 v43.18,66.67 34.92,66.67 26.67,74.93 26.67,77.6 U$1.P$22
DRX
  Top 0.203: J1.J2_12 35.56,6.35 J2.1
DTX
  Top 0.203: J1.J2_13 33.02,6.35 J2.3
EA
  Top 0.203: S1.A R23.1
EB
  Top 0.203: R20.1 S1.B
EN
  Top 0.203: J1.J2_18 20.32,6.35 19.68,6.99 R1.1
GND  (via drill 0.45)
  Top 0.203: U$1.P$26 29.21,77.6 29.21,75.56 | U$1.P$38 34.29,77.6 32.48,77.6 31.75,76.88 31.75,75.62 | U$1.P$66 54.61,77.6 54.61,75.56
  Bottom 0.203: U$1.P$10 19.02,77.62 21.98,77.62 22.86,76.75 U$1.P$17 | U$1.P$49 44.45,77.6 48.26,77.6 | U$1.P$66 52.07,77.6 48.26,77.6 | 48.26,77.6 U$1.P$58 48.26,79.29 47.43,80.11 36.39,80.11 35.56,79.29 U$1.P$38
  other vias: 13.97,69.85 19.05,26.67 27.94,15.88 31.75,23.5 34.29,23.5 36.83,23.5 39.37,23.5 34.29,73.66 36.83,73.66 39.37,73.66 27.94,72.39 29.21,73.66 31.11,74.3 81.28,71.12 41.91,23.5 44.45,23.5 46.99,23.5 49.53,23.5 52.07,23.5 54.61,23.5 46.99,73.66 49.53,74.3 52.07,28.57 52.07,34.29 52.07,39.37 52.07,43.81 52.07,48.9 52.07,54.61 52.07,59.69 52.07,64.14 52.07,69.85 54.61,69.85 54.61,64.14 54.61,59.69 54.61,54.61 54.61,48.9 54.61,43.81 54.61,39.37 54.61,34.29 54.61,28.57 26.67,1.91 10.79,2.54 45.72,5.71 55.88,74.3 58.42,43.81 59.69,64.14 76.83,52.07 21.59,26.67 24.13,26.67 27.3,23.5 10.79,83.82 10.79,81.28 12.7,3.81 2.54,11.43 5.08,70.48 38.1,19.05 34.29,36.83 36.83,34.29 36.83,39.37 44.45,39.37 46.99,41.91 81.28,34.29 81.28,36.83 81.28,31.75 81.28,41.91 81.28,39.37 76.83,46.99 41.91,15.88 44.45,15.88 54.61,6.99 78.74,68.58 55.24,72.39 72.39,3.17 26.67,9.53 85.72,67.31 85.72,41.91 65.41,27.3 52.07,31.75 54.61,31.75 24.13,9.53 36.83,59.69 34.29,59.69 44.45,59.69 46.99,59.69
  pour Bottom (isolate 0.305, rank 4): 1.27,87.63 87.63,87.63 87.63,1.27 1.27,1.27
  pour Top (isolate 0.305, rank 4): 1.27,87.63 87.63,87.63 87.63,1.27 1.27,1.27
GPIO22  (via drill 0.45)
  Top 0.203: v77.47,48.26 JP1.1
  Bottom 0.203: J1.J2_5 55.24,5.71 65.41,5.71 66.04,5.08 78.11,5.08 78.74,5.71 78.74,8.89 80.01,10.16 85.09,10.16 87,12.06 87,49.53 | U$1.P$57 49.11,76.33 54.32,71.12 79.38,71.12 80.64,72.39 85.09,72.39 87,70.48 87,49.53 | 87,49.53 78.74,49.53 v77.47,48.26
GPIO23
  Top 0.203: J1.J2_7 50.8,1.27 73.03,1.27 78.11,6.35 78.11,45.72 | JP2.1 78.11,45.72 | 78.11,45.72 60.33,45.72 58.42,47.62 58.42,73.66 57.15,74.93 57.15,79.44 56.45,80.14 52.07,80.14 U$1.P$62
LCD_BL
  Top 0.203: JP1.2 J6.10
LCD_CD  (via drill 0.45)
  Top 0.203: R10.1 v48.26,13.34 48.26,6.35 J1.J2_8 | v59.69,43.18 v59.69,20.32
  Bottom 0.203: J6.8 v59.69,43.18 | v59.69,20.32 59.05,19.68 51.44,19.68 48.26,16.51 v48.26,13.34
LCD_RST
  Top 0.203: J6.9 JP2.2
RX
  Top 0.203: J1.J2_11 39.37,5.08 39.37,9.89 R5.2
RXI  (via drill 0.45)
  Top 0.203: U$1.P$18 24.13,77.6 J3.1 | R5.1 30.85,12.33 v29.21,13.97
  Bottom 0.203: J3.1 22.86,39.37 22.86,29.21 29.21,22.86 v29.21,13.97
SCK  (via drill 0.45)
  Top 0.203: J1.J3_11 v38.1,33.02 38.1,73.79 U$1.P$45
  Bottom 0.203: v38.1,33.02 J6.4
SCL
  Top 0.203: J1.J3_16 25.4,24.77 24.77,25.4 U1.6 | R8.1 17.14,71.75 17.78,72.39 U$1.P$9
  Bottom 0.203: J1.J3_16 17.14,29.84 17.14,75.69 U$1.P$9
SDA
  Top 0.203: J1.J3_17 22.86,24.77 23.5,25.4 U1.5 | U$1.P$5 16.14,75.43 R7.1
  Bottom 0.203: J1.J3_17 15.24,29.21 U$1.P$5
TX
  Top 0.203: J1.J2_10 R6.2
TXO  (via drill 0.45)
  Top 0.203: U$1.P$14 19.05,77.6 J3.3 | R6.1 39.74,11.43 29.21,11.43 v26.67,13.97
  Bottom 0.203: J3.3 19.05,30.48 26.67,22.86 v26.67,13.97
USB5V
  Top 0.61: D1.C 11.43,16.51 | 11.43,16.51 C1.1 14.97,17.52 15.24,17.78 J1.J3_20 13.34,23.5 C8.+ | C2.1 11.43,16.51
VIN
  Top 0.203: R18.2 75.94,74.03 78.11,76.2 78.11,78.98 D2.A
  pour Top (isolate 0.305, rank 2): 62.23,80.01 62.23,74.3 64.14,72.39 76.83,72.39 76.83,74.93 67.31,74.93 67.31,80.01
VLED
  Top 0.203: D2.C 79.38,76.47 R22.2
VMON  (via drill 0.45)
  Top 0.203: R18.1 R19.2 79.11,72.02 81.28,69.85 86.36,69.85 87.63,68.58 87.63,11.43 85.72,9.53 80.64,9.53 79.38,8.26 79.38,3.81 v77.47,1.91
  Bottom 0.203: v77.47,1.91 32.38,1.91 J1.J2_14

### Text on the board
tPlace: APOLLO CONTROL REV B | JLCJLCJLCJLC